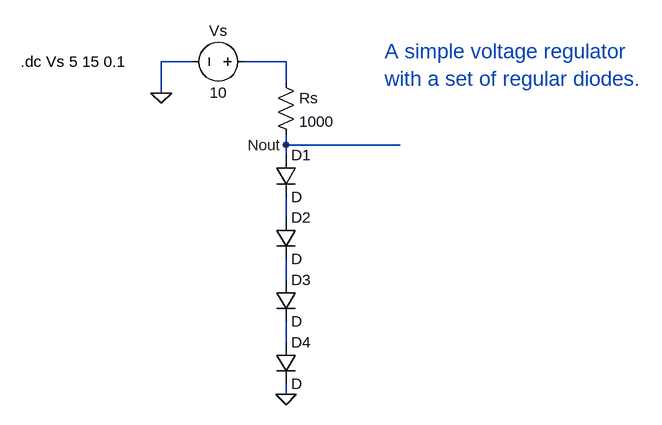
[diagram p0: schematic simple_voltage_regulator.asc]
simple_voltage_regulator.asc, the LTspice schematic file:
Version 4
SHEET 1 880 680
WIRE -208 96 -256 96
WIRE -64 96 -128 96
WIRE -64 128 -64 96
WIRE -256 144 -256 96
WIRE -64 224 -64 208
WIRE 112 224 -64 224
WIRE -64 240 -64 224
WIRE -64 336 -64 304
WIRE -64 432 -64 400
WIRE -64 528 -64 496
WIRE -64 608 -64 592
FLAG -64 608 0
FLAG -256 144 0
FLAG -64 224 Nout
SYMBOL diode -80 240 R0
SYMATTR InstName D1
SYMBOL diode -80 336 R0
WINDOW 0 55 0 Right 2
SYMATTR InstName D2
SYMBOL diode -80 432 R0
SYMATTR InstName D3
SYMBOL diode -80 528 R0
SYMATTR InstName D4
SYMBOL res -80 112 R0
SYMATTR InstName Rs
SYMATTR Value 1000
SYMBOL voltage -112 96 R90
WINDOW 0 -32 56 VBottom 2
WINDOW 3 32 56 VTop 2
SYMATTR InstName Vs
SYMATTR Value 10
TEXT -472 96 Left 2 !.dc Vs 5 15 0.1
TEXT 88 80 Left 3 ;A simple voltage regulator \nwith a set of regular diodes.

The netlist it stands for:
* simple_voltage_regulator.asc
D1 Nout N002 D
D2 N002 N003 D
D3 N003 N004 D
D4 N004 0 D
Rs N001 Nout 1000
Vs N001 0 10
.model D D
.lib standard.dio
.dc Vs 5 15 0.1
* A simple voltage regulator
* with a set of regular diodes.
.backanno
.end